# EAGLE board reva (EAGLE 9.6.2)
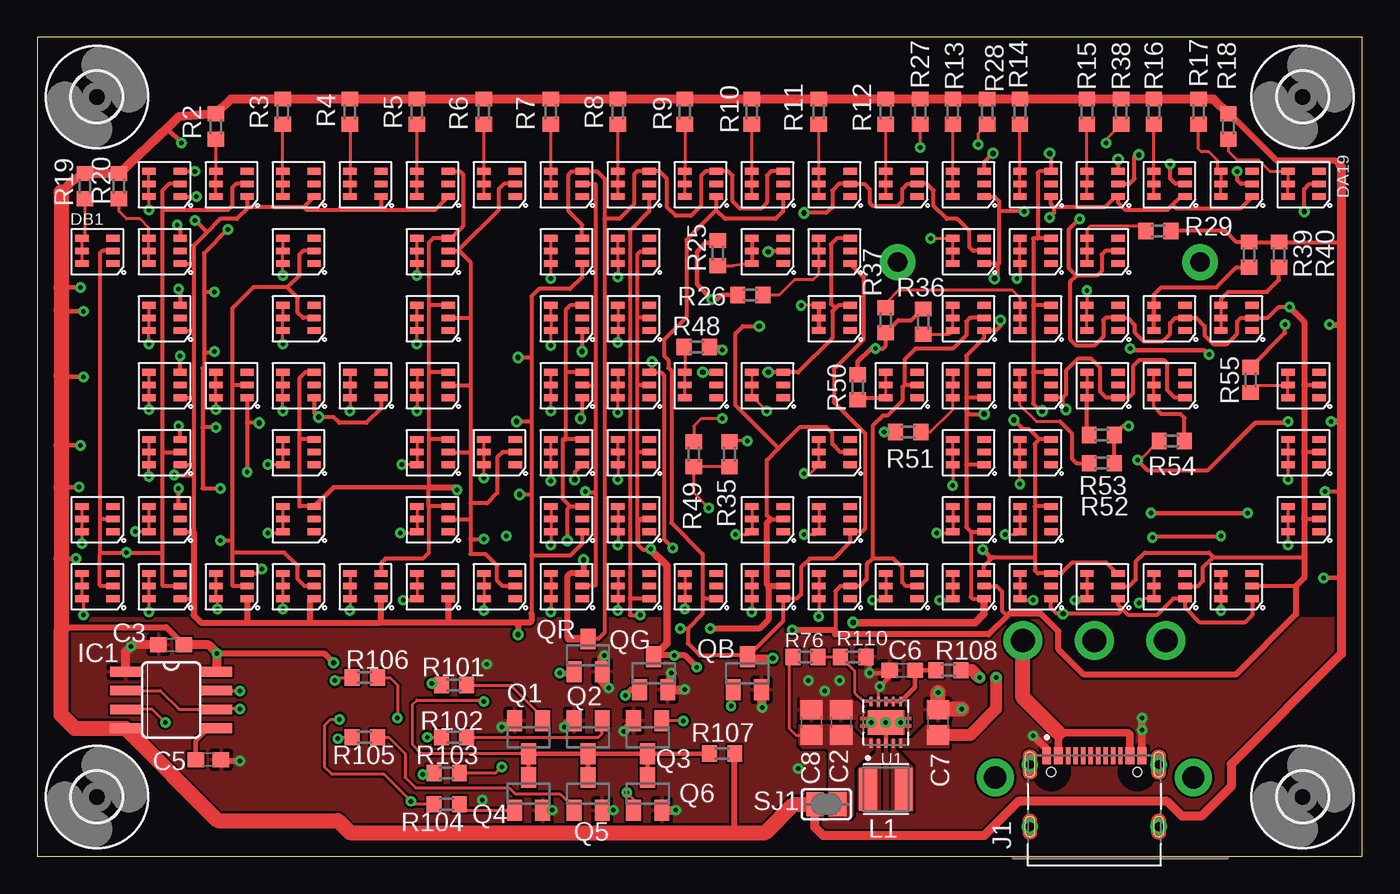
[diagram p2: board, top side]
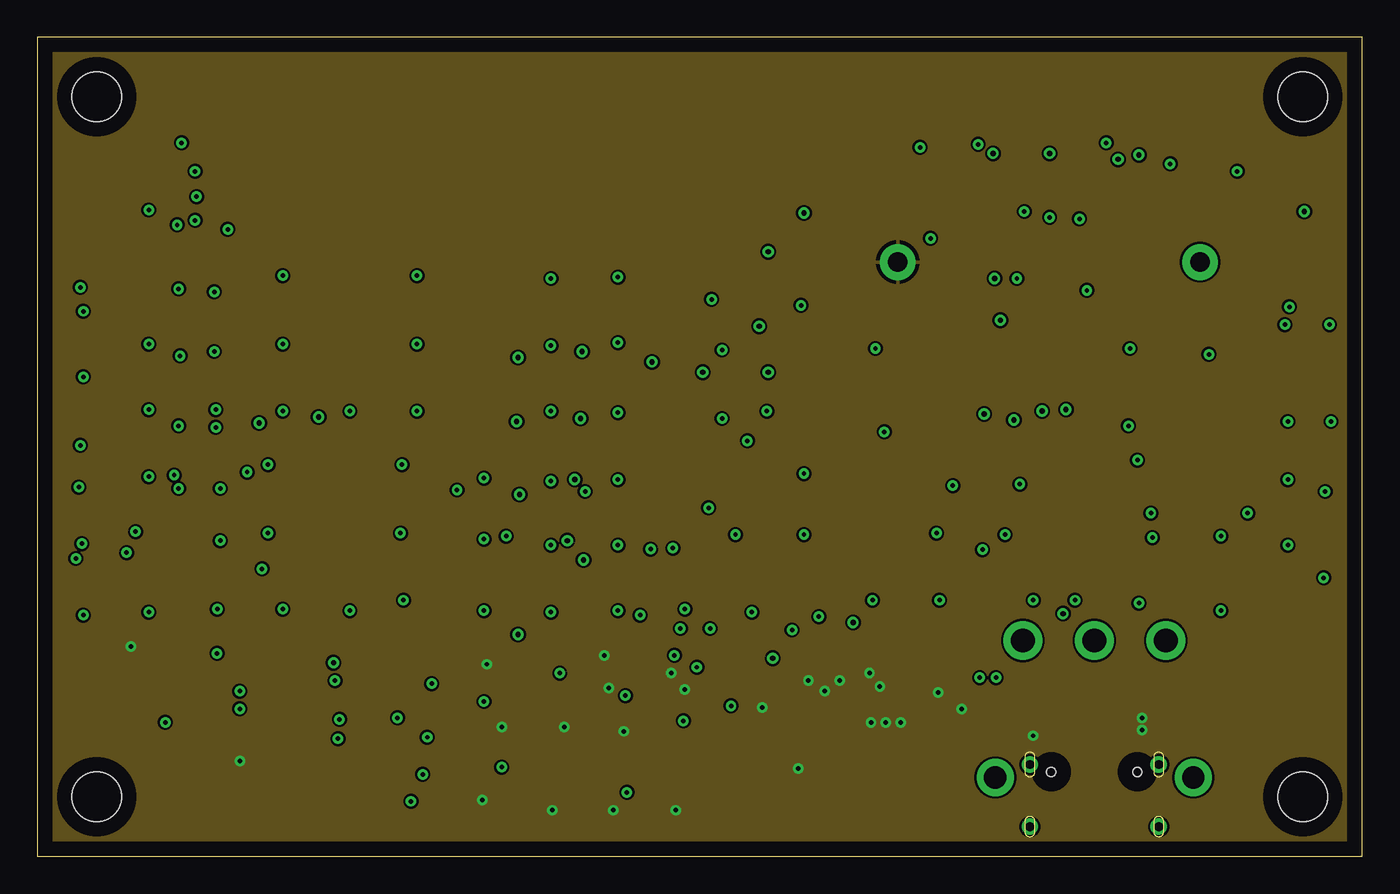
[diagram p3: board, inner layer Route2]
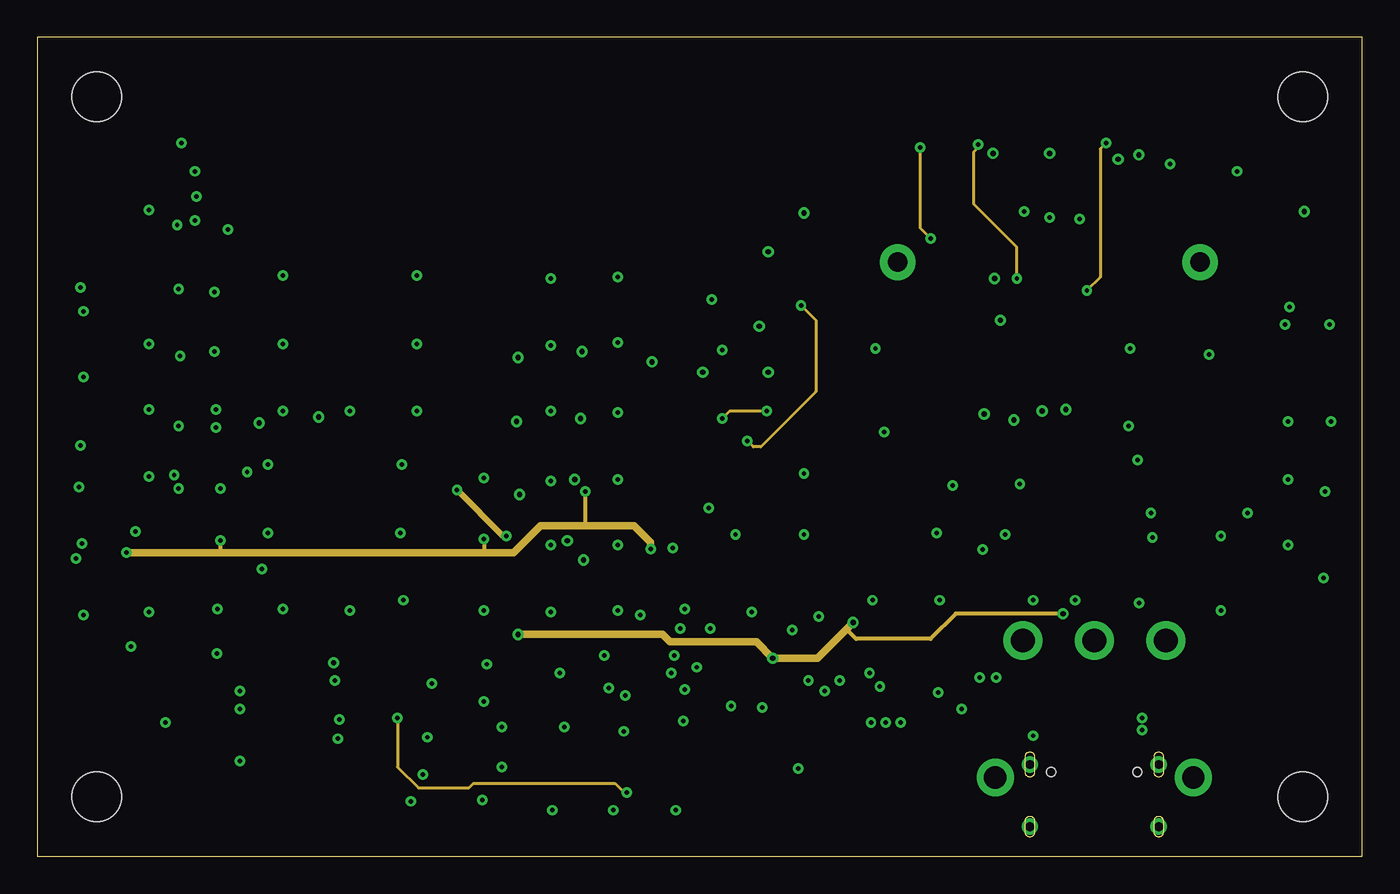
[diagram p4: board, inner layer Route15]
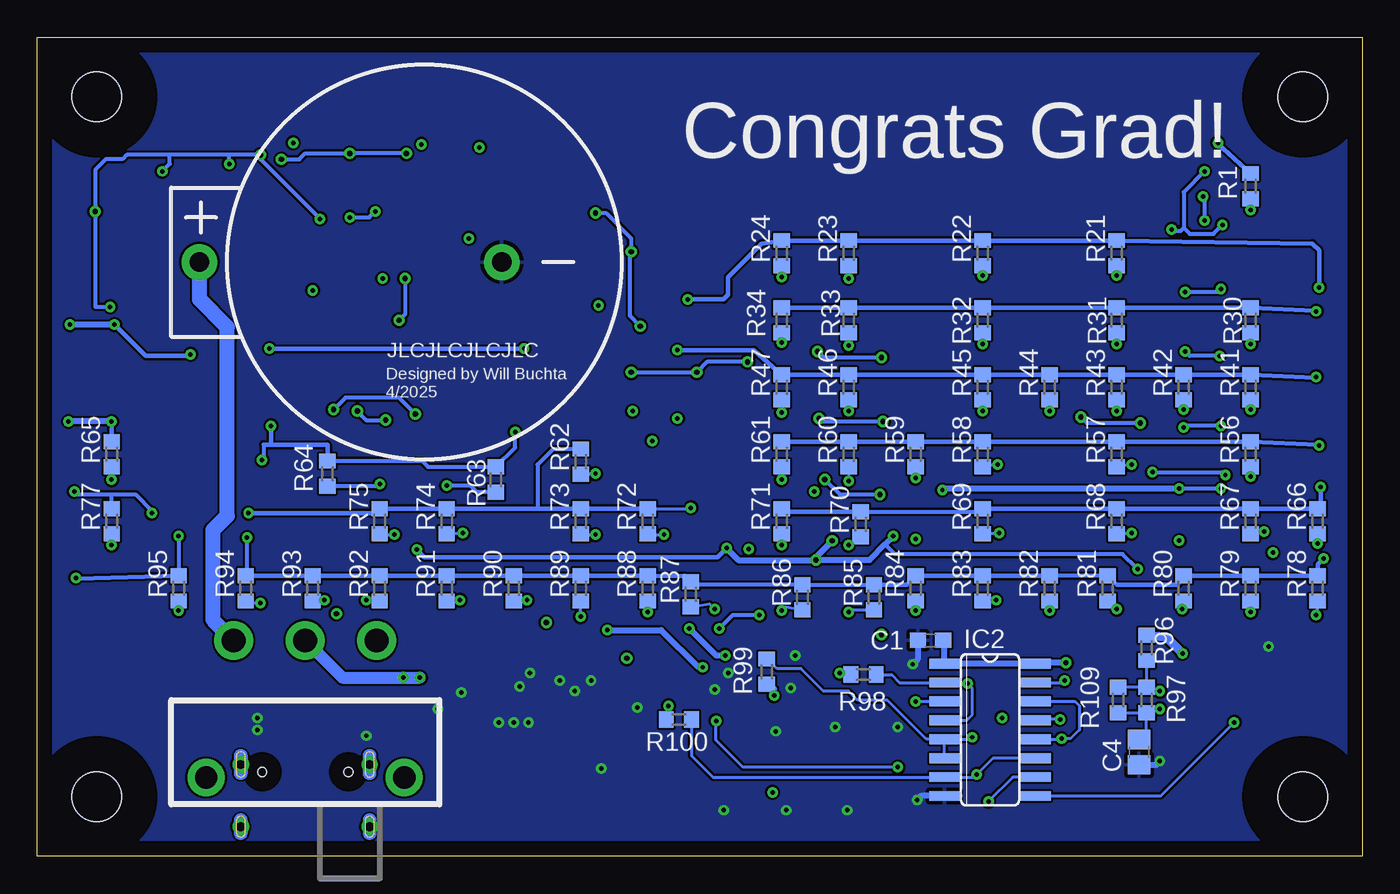
[diagram p5: board, bottom side, seen from below]

Size 89 x 55 mm. Coordinates in mm from the lower left corner, seen from the top.
Outline: 0,0 89,0 89,55 0,55 0,0
Copper layers (1+2*15+16): Top 0.035mm / dielectric 0.15mm / Route2 0.035mm / dielectric 0.15mm / Route15 0.035mm / dielectric 0.2mm / Bottom 0.035mm
Design rules "jlc-4 *": minimum track width 6mil, minimum drill 0.2mm, track to track 6mil, track to pad 6mil, pad to pad 6mil, via to via 6mil, smd to smd 0mil, copper to edge 1mm, drill to drill 0.33mm, minimum pad ring 0.25mm, minimum via ring 0.2mm, stop-mask expansion 4mil, vias tented up to drill 0.35mm, thermal gap 10mil

## Footprints (pad centres in the part's own frame; a part is rotated, then mirrored left to right if it is on the bottom)
CR240_CASE = drill 1.3 pad 2.4: NEG -5.2,0; POS 15.1,0
C0603 = smd 1.1 x 1: 1 -0.85,0; 2 0.85,0
C0805 = smd 1.3 x 1.5: 1 -0.85,0; 2 0.85,0
LED2727 = smd 0.9 x 0.45: 1 2.1,-1.7; 2 2.1,-0.85; 3 2.1,0; 4 0,0; 5 0,-0.85; 6 0,-1.7
3,3 = hole 3.3: 0,0
SO08 = smd 0.66 x 2.032: 1 -1.905,-3.073; 2 -0.635,-3.073; 3 0.635,-3.073; 4 1.905,-3.073; 5 1.905,3.073; 6 0.635,3.073; 7 -0.635,3.073; 8 -1.905,3.073
SO16 = smd 0.66 x 2.032: 1 -4.445,-3.073; 2 -3.175,-3.073; 3 -1.905,-3.073; 4 -0.635,-3.073; 5 0.635,-3.073; 6 1.905,-3.073; 7 3.175,-3.073; 8 4.445,-3.073; 9 4.445,3.073; 10 3.175,3.073; 11 1.905,3.073; 12 0.635,3.073; 13 -0.635,3.073; 14 -1.905,3.073; 15 -3.175,3.073; 16 -4.445,3.073
HRO_TYPE-C-31-M-12 = smd 0.6 x 1.14: A1_B12 -3.2,4.75; A4_B9 -2.4,4.75; B1_A12 3.2,4.75; B4_A9 2.4,4.75 | smd 0.3 x 1.14: A5 -1.25,4.75; A6 -0.25,4.75; A7 0.25,4.75; A8 1.25,4.75; B5 1.75,4.75; B6 0.75,4.75; B7 -0.75,4.75; B8 -1.75,4.75 | drill 0.6 pad 0.9: S1 -4.325,4.17; S2 4.325,4.17; S3 -4.325,0; S4 4.325,0 | hole 0.6: -2.89,3.68; 2.89,3.68
IND_LQH3NPN2R2MJRL = smd 1.2 x 2.9: 1 -1.2,0; 2 1.2,0
SW-K31391B = drill 1.6 pad 2.6: COM 0,0; L -4.8,0; R 4.8,0 | drill 1.5 pad 2.5: P$4 -6.65,9.2; P$5 6.65,9.2
SOT23 = smd 1 x 1.4: 1 -0.95,-1.1; 2 0.95,-1.1; 3 0,1.1
R0603 = smd 1 x 1.1: 1 -0.85,0; 2 0.85,0
SJ = smd 1.168 x 1.6: 1 -0.762,0; 2 0.762,0
VREG_V62/16624-01YE = smd 0.6 x 0.24: 1 -1.4,1; 2 -1.4,0.5; 3 -1.4,0; 4 -1.4,-0.5; 5 -1.4,-1; 6 1.4,-1; 7 1.4,-0.5; 8 1.4,0; 9 1.4,0.5; 10 1.4,1 | smd 1.65 x 2.4: 11 0,0

## Placement (x,y rotation side)
BAT1  CR2450  [CR240_CASE]  63,39.9 180 bottom
C1  100n  [C0603]  29,14.5 180 bottom
C2  10u  [C0805]  54,9 90 top
C3  100n  [C0603]  9,14.2 180 top
C4  10u  [C0805]  15,7 270 bottom
C5  100n  [C0603]  11.5,6.5 0 top
C6  100n  [C0603]  58.1,12.5 180 top
C7  10u  [C0805]  60.5,9 90 top
C8  10u  [C0805]  52,9 90 top
DA2  RGB_LED_XL  [LED2727]  7.5,46 0 top
DA3  RGB_LED_XL  [LED2727]  12,46 0 top
DA4  RGB_LED_XL  [LED2727]  16.5,46 0 top
DA5  RGB_LED_XL  [LED2727]  21,46 0 top
DA6  RGB_LED_XL  [LED2727]  25.5,46 0 top
DA7  RGB_LED_XL  [LED2727]  30,46 0 top
DA8  RGB_LED_XL  [LED2727]  34.5,46 0 top
DA9  RGB_LED_XL  [LED2727]  39,46 0 top
DA10  RGB_LED_XL  [LED2727]  43.5,46 0 top
DA11  RGB_LED_XL  [LED2727]  48,46 0 top
DA12  RGB_LED_XL  [LED2727]  52.5,46 0 top
DA13  RGB_LED_XL  [LED2727]  57,46 0 top
DA14  RGB_LED_XL  [LED2727]  61.5,46 0 top
DA15  RGB_LED_XL  [LED2727]  66,46 0 top
DA16  RGB_LED_XL  [LED2727]  70.5,46 0 top
DA17  RGB_LED_XL  [LED2727]  75,46 0 top
DA18  RGB_LED_XL  [LED2727]  79.5,46 0 top
DA19  RGB_LED_XL  [LED2727]  84,46 0 top
DB1  RGB_LED_XL  [LED2727]  3,41.5 0 top
DB2  RGB_LED_XL  [LED2727]  7.5,41.5 0 top
DB4  RGB_LED_XL  [LED2727]  16.5,41.5 0 top
DB6  RGB_LED_XL  [LED2727]  25.5,41.5 0 top
DB8  RGB_LED_XL  [LED2727]  34.5,41.5 0 top
DB9  RGB_LED_XL  [LED2727]  39,41.5 0 top
DB11  RGB_LED_XL  [LED2727]  48,41.5 0 top
DB12  RGB_LED_XL  [LED2727]  52.5,41.5 0 top
DB14  RGB_LED_XL  [LED2727]  61.5,41.5 0 top
DB15  RGB_LED_XL  [LED2727]  66,41.5 0 top
DB16  RGB_LED_XL  [LED2727]  70.5,41.5 0 top
DC2  RGB_LED_XL  [LED2727]  7.5,37 0 top
DC4  RGB_LED_XL  [LED2727]  16.5,37 0 top
DC6  RGB_LED_XL  [LED2727]  25.5,37 0 top
DC8  RGB_LED_XL  [LED2727]  34.5,37 0 top
DC9  RGB_LED_XL  [LED2727]  39,37 0 top
DC12  RGB_LED_XL  [LED2727]  52.5,37 0 top
DC14  RGB_LED_XL  [LED2727]  61.5,37 0 top
DC15  RGB_LED_XL  [LED2727]  66,37 0 top
DC16  RGB_LED_XL  [LED2727]  70.5,37 0 top
DC17  RGB_LED_XL  [LED2727]  75,37 0 top
DC18  RGB_LED_XL  [LED2727]  79.5,37 0 top
DD2  RGB_LED_XL  [LED2727]  7.5,32.5 0 top
DD3  RGB_LED_XL  [LED2727]  12,32.5 0 top
DD4  RGB_LED_XL  [LED2727]  16.5,32.5 0 top
DD5  RGB_LED_XL  [LED2727]  21,32.5 0 top
DD6  RGB_LED_XL  [LED2727]  25.5,32.5 0 top
DD8  RGB_LED_XL  [LED2727]  34.5,32.5 0 top
DD9  RGB_LED_XL  [LED2727]  39,32.5 0 top
DD10  RGB_LED_XL  [LED2727]  43.5,32.5 0 top
DD11  RGB_LED_XL  [LED2727]  48,32.5 0 top
DD13  RGB_LED_XL  [LED2727]  57,32.5 0 top
DD14  RGB_LED_XL  [LED2727]  61.5,32.5 0 top
DD15  RGB_LED_XL  [LED2727]  66,32.5 0 top
DD16  RGB_LED_XL  [LED2727]  70.5,32.5 0 top
DD17  RGB_LED_XL  [LED2727]  75,32.5 0 top
DD19  RGB_LED_XL  [LED2727]  84,32.5 0 top
DE2  RGB_LED_XL  [LED2727]  7.5,28 0 top
DE4  RGB_LED_XL  [LED2727]  16.5,28 0 top
DE6  RGB_LED_XL  [LED2727]  25.5,28 0 top
DE7  RGB_LED_XL  [LED2727]  30,28 0 top
DE8  RGB_LED_XL  [LED2727]  34.5,28 0 top
DE9  RGB_LED_XL  [LED2727]  39,28 0 top
DE12  RGB_LED_XL  [LED2727]  52.5,28 0 top
DE14  RGB_LED_XL  [LED2727]  61.5,28 0 top
DE15  RGB_LED_XL  [LED2727]  66,28 0 top
DE19  RGB_LED_XL  [LED2727]  84,28 0 top
DF1  RGB_LED_XL  [LED2727]  3,23.5 0 top
DF2  RGB_LED_XL  [LED2727]  7.5,23.5 0 top
DF4  RGB_LED_XL  [LED2727]  16.5,23.5 0 top
DF6  RGB_LED_XL  [LED2727]  25.5,23.5 0 top
DF8  RGB_LED_XL  [LED2727]  34.5,23.5 0 top
DF9  RGB_LED_XL  [LED2727]  39,23.5 0 top
DF11  RGB_LED_XL  [LED2727]  48,23.5 0 top
DF12  RGB_LED_XL  [LED2727]  52.5,23.5 0 top
DF14  RGB_LED_XL  [LED2727]  61.5,23.5 0 top
DF15  RGB_LED_XL  [LED2727]  66,23.5 0 top
DF19  RGB_LED_XL  [LED2727]  84,23.5 0 top
DG1  RGB_LED_XL  [LED2727]  3,19 0 top
DG2  RGB_LED_XL  [LED2727]  7.5,19 0 top
DG3  RGB_LED_XL  [LED2727]  12,19 0 top
DG4  RGB_LED_XL  [LED2727]  16.5,19 0 top
DG5  RGB_LED_XL  [LED2727]  21,19 0 top
DG6  RGB_LED_XL  [LED2727]  25.5,19 0 top
DG7  RGB_LED_XL  [LED2727]  30,19 0 top
DG8  RGB_LED_XL  [LED2727]  34.5,19 0 top
DG9  RGB_LED_XL  [LED2727]  39,19 0 top
DG10  RGB_LED_XL  [LED2727]  43.5,19 0 top
DG11  RGB_LED_XL  [LED2727]  48,19 0 top
DG12  RGB_LED_XL  [LED2727]  52.5,19 0 top
DG13  RGB_LED_XL  [LED2727]  57,19 0 top
DG14  RGB_LED_XL  [LED2727]  61.5,19 0 top
DG15  RGB_LED_XL  [LED2727]  66,19 0 top
DG16  RGB_LED_XL  [LED2727]  70.5,19 0 top
DG17  RGB_LED_XL  [LED2727]  75,19 0 top
DG18  RGB_LED_XL  [LED2727]  79.5,19 0 top
H1  MOUNT-HOLE3.3  [3,3]  85,51 0 top
H2  MOUNT-HOLE3.3  [3,3]  4,51 0 top
H3  MOUNT-HOLE3.3  [3,3]  4,4 0 top
H4  MOUNT-HOLE3.3  [3,3]  85,4 0 top
IC1  LM555D  [SO08]  9,10.5 270 top
IC2  74HC174D  [SO16]  25,8.5 270 bottom
J1  TYPE-C-31-M-12  [HRO_TYPE-C-31-M-12]  71,2 0 top
L1  LQH3NPN2R2MJRL  [IND_LQH3NPN2R2MJRL]  57,4.5 180 top
PWR  SWITCH-BRUH  [SW-K31391B]  71,14.5 180 bottom
Q1  [SOT23]  33,8 180 top
Q2  [SOT23]  37,8 180 top
Q3  [SOT23]  41,8 180 top
Q4  [SOT23]  33,4.2 0 top
Q5  [SOT23]  37,4.2 0 top
Q6  [SOT23]  41,4.2 0 top
QB  [SOT23]  47.7,12.3 0 top
QG  [SOT23]  41.4,12.3 0 top
QR  [SOT23]  37,13.5 0 top
R1  470  [R0603]  7.5,45 90 bottom
R2  470  [R0603]  12,49 90 top
R3  [R0603]  16.5,50 90 top
R4  [R0603]  21,50 90 top
R5  [R0603]  25.5,50 90 top
R6  [R0603]  30,50 90 top
R7  [R0603]  34.5,50 90 top
R8  [R0603]  39,50 90 top
R9  [R0603]  43.5,50 90 top
R10  [R0603]  48,50 90 top
R11  [R0603]  52.5,50 90 top
R12  [R0603]  57,50 90 top
R13  [R0603]  61.5,50 90 top
R14  [R0603]  66,50 90 top
R15  [R0603]  70.5,50 90 top
R16  [R0603]  75,50 90 top
R17  [R0603]  78,50 90 top
R18  [R0603]  80,49 90 top
R19  [R0603]  3.2,45 90 top
R20  [R0603]  5.5,45 90 top
R21  [R0603]  16.5,40.5 90 bottom
R22  [R0603]  25.5,40.5 90 bottom
R23  [R0603]  34.5,40.5 90 bottom
R24  [R0603]  39,40.5 90 bottom
R25  [R0603]  45.7,40.5 90 top
R26  [R0603]  47.9,37.7 180 top
R27  [R0603]  59.3,50 90 top
R28  [R0603]  63.8,50 90 top
R29  [R0603]  75.3,42 0 top
R30  [R0603]  7.5,36 90 bottom
R31  [R0603]  16.5,36 90 bottom
R32  [R0603]  25.5,36 90 bottom
R33  [R0603]  34.5,36 90 bottom
R34  [R0603]  39,36 90 bottom
R35  [R0603]  46.5,27 270 top
R36  [R0603]  59.5,35.9 90 top
R37  [R0603]  57,36 270 top
R38  [R0603]  72.8,50 90 top
R39  [R0603]  81.4,40.4 90 top
R40  [R0603]  83.4,40.4 90 top
R41  [R0603]  7.5,31.5 90 bottom
R42  [R0603]  12,31.5 90 bottom
R43  [R0603]  16.5,31.5 90 bottom
R44  [R0603]  21,31.5 90 bottom
R45  [R0603]  25.5,31.5 90 bottom
R46  [R0603]  34.5,31.5 90 bottom
R47  [R0603]  39,31.5 90 bottom
R48  [R0603]  44.3,34.2 0 top
R49  [R0603]  44.1,27 270 top
R50  [R0603]  55.1,31.5 90 top
R51  [R0603]  58.5,28.5 180 top
R52  [R0603]  71.5,26.4 0 top
R53  [R0603]  71.5,28.3 0 top
R54  [R0603]  76.2,27.9 180 top
R55  [R0603]  81.5,32 90 top
R56  [R0603]  7.5,27 90 bottom
R57  [R0603]  16.5,27 90 bottom
R58  [R0603]  25.5,27 90 bottom
R59  [R0603]  30,27 90 bottom
R60  [R0603]  34.5,27 90 bottom
R61  [R0603]  39,27 90 bottom
R62  [R0603]  52.5,26.5 90 bottom
R63  [R0603]  58.2,25.3 90 bottom
R64  [R0603]  69.5,25.7 90 bottom
R65  [R0603]  84,27 90 bottom
R66  [R0603]  3,22.5 90 bottom
R67  [R0603]  7.5,22.5 90 bottom
R68  [R0603]  16.5,22.5 90 bottom
R69  [R0603]  25.5,22.5 90 bottom
R70  [R0603]  33.7,22.3 90 bottom
R71  [R0603]  39,22.5 90 bottom
R72  [R0603]  48,22.5 90 bottom
R73  [R0603]  52.5,22.5 90 bottom
R74  [R0603]  61.5,22.5 90 bottom
R75  [R0603]  66,22.5 90 bottom
R76  71k  [R0603]  51.6,13.4 180 top
R77  [R0603]  84,22.5 90 bottom
R78  [R0603]  3,18 90 bottom
R79  [R0603]  7.5,18 90 bottom
R80  [R0603]  12,18 90 bottom
R81  [R0603]  17.1,18 90 bottom
R82  [R0603]  21,18 90 bottom
R83  [R0603]  25.5,18 90 bottom
R84  [R0603]  30,18 90 bottom
R85  [R0603]  32.8,17.4 90 bottom
R86  [R0603]  37.6,17.4 90 bottom
R87  [R0603]  45.1,17.6 90 bottom
R88  [R0603]  48,18 90 bottom
R89  [R0603]  52.5,18 90 bottom
R90  [R0603]  57,18 90 bottom
R91  [R0603]  61.5,18 90 bottom
R92  [R0603]  66,18 90 bottom
R93  [R0603]  70.5,18 90 bottom
R94  [R0603]  75,18 90 bottom
R95  [R0603]  79.5,18 90 bottom
R96  75k  [R0603]  14.5,14 90 bottom
R97  75k  [R0603]  14.5,10.5 90 bottom
R98  470  [R0603]  33.5,12.2 0 bottom
R99  470  [R0603]  40,12.4 90 bottom
R100  470  [R0603]  45.9,9.2 0 bottom
R101  4k7  [R0603]  28,11.5 180 top
R102  4k7  [R0603]  28,8 180 top
R103  4k7  [R0603]  27.5,5.6 180 top
R104  4k7  [R0603]  27.5,3.5 180 top
R105  4k7  [R0603]  22,8 180 top
R106  4k7  [R0603]  22,12 180 top
R107  4k7  [R0603]  46,6.9 180 top
R108  100  [R0603]  61.2,12.5 0 top
R109  75k  [R0603]  16.4,10.5 90 bottom
R110  75k  [R0603]  54.8,13.4 180 top
SJ1  [SJ]  53,3.5 180 top
U1  TPS63000DRCR  [VREG_V62/16624-01YE]  57,9 90 top

## Tracks (layer width: path | path; a pad name or v marks a point on that pad's centre or on a via)
5VBUCK
  Top 0.2: R76.2 50.5,13.1 50.5,8.6 50.95,8.15 C8.1
  pour Top (no thermals): 56.1,7.9 55.3,7.9 54.7,8.5 54.7,8.8 51.2,8.8 51.2,7.5 51.4,7.3 53,7.3 53.2,7.1 53.2,2.7 53.3,2.6 54.6,2.6 54.8,2.8 54.8,5.9 56.1,7.2
+5V  (via drill 0.3, 0.3 pad 0.45, 0.3 pad 0.5, 0.35)
  Top 0.2: R35.2 R49.2 44.1,24.4 v45.1,23.4 | R38.2 72.6,50.85 | R28.2 63.6,50.85 | R27.2 59.4,50.85 | R54.2 74.05,26.6 v73.9,26.6
  Top 0.254: v74.9,21.4 75,21.5 v79.5,21.5 | v86.5,24.5 87.5,24.5 87.6,24.6 | 87.6,40.9 87.45,41.05 | R39.2 81.15,41.05 | R39.2 80.55,41.25 79.8,42 R29.2 76.05,41.9 | R39.2 R40.2 87.55,41.25 87.6,41.2 | R52.2 R53.2 72.95,28.9 v73.3,28.9 | 80.2,27.5 78.6,25.9 74.6,25.9 v73.9,26.6 | R55.2 83.8,35.15 v83.8,35.7 | v56.3,34.1 56.8,34.1 57,34.3 R37.2 57.85,36 58.7,36 59.45,36.75
  Top 0.305: v9.7,47.9 8.78,48.83 8.78,48.92 | v2.9,38.2 1.6,38.2 | v3.1,36.6 1.7,36.6 1.6,36.7 | v3.1,32.2 1.7,32.2 1.6,32.3 | 87.5,29.2 87.6,29.1 | R53.2 72.25,28.2 | v2.9,27.6 1.6,27.6 | v2.8,24.8 1.6,24.8 | v81.3,23.05 v74.8,23.05 | v86.4,18.7 87.6,18.7 | v2.6,20 1.6,20 | R26.2 46,37.7 45.7,37.4 v45.3,37.4 44.3,38.4 44.3,40.6 44.9,41.2 45.65,41.2 R25.2 46.05,41.35 | 59.45,36.75 R36.2 | 80.2,27.5 81.8,29.1 83.9,29.1 v84,29.2 | R50.2 55.1,33.2 56,34.1 v56.3,34.1 | R51.2 v56.9,28.5 | R48.2 45.8,34.2 v46,34 | v78.7,33.7 78.4,34 73.5,34 v73.4,34.1
  Top 0.406: R18.2 80.31,49.65 83.23,46.73 87.17,46.73 87.5,46.4 | v86.8,35.7 87.4,35.7 87.6,35.9 | v86.9,29.2 87.5,29.2 | 1.6,15.1 1.9,15.4 8.65,15.4 C3.1 | v12.07,13.63 19.27,13.63 v19.9,13 | R107.1 46.8,6.75 46.8,1.6
  Top 0.61: R18.2 79,50.85 R17.2 R16.2 72.6,50.85 R15.2 R14.2 63.6,50.85 R13.2 59.4,50.85 R12.2 R11.2 R10.2 R9.2 R8.2 R7.2 R6.2 R5.2 R4.2 R3.2 13,50.85 R2.2 9.5,49.65 8.78,48.92 R20.2 R19.2 2.38,45.38 1.6,44.59 | 87.5,46.4 87.6,46.3 87.6,41.2 87.6,40.9 87.6,35.9 87.6,29.1 87.6,24.6 87.6,18.7 87.6,13.6 80.2,6.2 80.2,4.7 78.2,2.7 76.9,2.7 75.9,3.7 65.9,3.7 63.6,1.4 52.8,1.4 52.24,1.96 SJ1.2 | IC1.8 v12.07,13.63 11.5,14.2 C3.1
  Top 1.016: 1.6,44.59 1.6,38.2 1.6,36.7 1.6,32.3 1.6,27.6 1.6,24.8 1.6,20 1.6,15.1 1.6,9.5 2.5,8.6 IC1.4 12.12,2.4 20.2,2.4 21,1.6 46.8,1.6 48.9,1.6 50.8,3.5 SJ1.2
  Bottom 0.2: R72.2 45.15,23.35 v45.1,23.4
  Bottom 0.254: 73.8,27.65 73.8,26.7 v73.9,26.6 | 74.7,23.05 v74.8,23.05 | R94.2 74.9,18.75 v74.9,21.4 | v79.5,21.5 R95.2 | 84.1,24.3 86.3,24.3 v86.5,24.5 | 84.1,24.3 82.4,24.3 81.3,23.2 v81.3,23.05 | R64.2 63.15,26.55 62.75,26.15 R63.2 56.9,27.45 v56.9,28.5 | R62.2 54.35,27.35 55.4,26.3 55.4,23.35 | R77.2 84,24.2 84.1,24.3 | R88.2 45.5,18.85 R87.2 | 45.04,18.33 44.96,18.25 R86.2 32.95,18.25 32.88,18.18 | R82.2 R81.2 16.5,18.25 | R70.2 25.7,23.15 R69.2
  Bottom 0.305: R1.2 9.7,47.85 v9.7,47.9 | v2.9,38.2 2.9,40.7 3.35,41.15 R21.2 R22.2 R23.2 R24.2 40.35,41.15 42.6,38.9 42.6,37.7 42.9,37.4 v45.3,37.4 | v3.1,36.6 3.15,36.65 R30.2 R31.2 R32.2 R33.2 R34.2 | v3.1,32.2 3.15,32.15 R41.2 R42.2 R43.2 R44.2 R45.2 R46.2 R47.2 40.85,34 v46,34 | R65.2 v84,29.2 | 73.8,27.65 73.3,27.65 | 73.3,27.65 69.5,27.65 R64.2 | 73.3,27.65 v73.3,28.9 | R62.2 52.7,27.35 | R61.2 R60.2 R59.2 R58.2 R57.2 R56.2 2.95,27.65 v2.9,27.6 | v2.8,24.8 2.8,23.35 R66.2 R67.2 R68.2 R69.2 | R70.2 38.8,23.15 R71.2 | R72.2 R73.2 55.4,23.35 R74.2 R75.2 66.1,23.05 74.7,23.05 | R95.2 86.35,18.65 v86.4,18.7 | R94.2 R93.2 R92.2 R91.2 R90.2 R89.2 R88.2 | R87.2 45.04,18.33 44.9,18.05 | 33,18.05 32.88,18.18 R85.2 30.6,18.25 R84.2 R83.2 R82.2 | 16.5,18.25 12.4,18.25 R80.2 R79.2 R78.2 3,19.6 v2.6,20 | v78.7,33.7 78.8,33.6 81.7,33.6 v83.8,35.7 | v73.4,34.1 v56.3,34.1 | 83.7,23.05 R77.2
  Bottom 0.406: v83.8,35.7 v86.8,35.7 | v84,29.2 v86.9,29.2 | C1.1 28.07,14.42 IC2.1 IC2.16 21.87,13 v19.9,13
  Bottom 0.61: R96.2 13.19,14.74 v12.07,13.63
B-  (via drill 0.3 pad 0.45, 0.3 pad 0.5, 0.35)
  Top 0.254: DA9.1 41.1,43.3 39.8,42 39.8,17.3 | 39.8,17.3 39.8,16.2 v40.5,16.2 | DA10.1 45.6,43.4 | 45.6,43.4 43.6,41.4 43.6,36.2 42.1,34.7 42.1,33.6 42.4,33.3 42.4,32.8 42.6,32.6 42.6,22.4 44.7,20.3 44.7,17.3 | DA3.1 14.1,43.6 | 14.1,43.6 14.1,43.5 13.4,42.8 12.3,42.8 11.3,41.8 | 11.3,41.8 10.5,41 10.5,39.8 | 10.5,39.8 10.5,35.3 | 10.5,35.3 10.5,30.8 | 10.5,30.8 10.5,26.2 | 10.5,26.2 10.5,25.6 | 10.5,25.6 10.5,21.8 DF2.1 | DG2.1 10.5,17.3 | DE2.1 10.4,26.3 10.5,26.2 | DD2.1 10.5,30.8 | DC2.1 10.5,35.3 | DB2.1 10.5,39.8 | DA2.1 v10.7,44.3 | v10.6,42.7 11.3,42 11.3,41.8 | DA4.1 17.9,43.6 | 17.9,43.6 14.1,43.6 | DA5.1 23.1,43.4 | 23.1,43.4 18.1,43.4 17.9,43.6 | DA6.1 26.7,43.4 23.1,43.4 | DD3.1 14.1,29.1 | 14.1,29.1 v14.1,25.8 | DD4.1 18.6,29.8 v18.9,29.5 19.9,29.5 20.3,29.1 22.1,29.1 23.1,30.1 DD5.1 | v14.9,29.1 14.1,29.1 | DB8.1 36.6,38.9 35.8,38.1 33.7,38.1 33.2,37.6 33.2,33.5 | 33.2,33.5 33.2,29.2 | 33.2,29.2 33.2,24.3 | 33.2,24.3 33.2,20.2 | 33.2,20.2 33.2,16.3 | DF8.1 36.6,21 35.8,20.2 33.2,20.2 | DG6.1 27.6,17.2 | 23.1,17.2 DG5.1 | DG9.1 39.8,17.3 | DC8.1 v36.6,33.9 | v32.3,33.5 33.2,33.5 | DD8.1 36.6,29.5 v36.5,29.4 | v32.2,29.2 33.2,29.2 | DE8.1 36.1,25.8 v36.1,25.3 | v32.4,24.3 33.2,24.3 | DA11.1 50.1,43.3 49.6,42.8 46.2,42.8 45.6,43.4 | DG10.1 44.7,17.3 | DB12.1 55.5,38.9 55.5,34.7 53.5,32.7 53.5,30.5 55.6,28.4 55.6,22 55.4,21.8 DF12.1 54.6,21.1 53.5,20 51.9,20 51.3,19.4 51.3,17.6 51,17.3 DG11.1 50.1,15.8 QB.3 47.6,13.5 45.4,13.5 | DA14.1 64.3,44.3 64.6,44 64.6,43.3 | 64.5,39.8 64.6,39.8 64.6,43.3 | 64.5,39.8 DB14.1 | 62.4,30.8 62.4,33.6 63.6,34.8 DC14.1 64.4,35.3 64.7,35.6 v64.7,36 | DD14.1 62.4,30.8 | 62.7,21.8 62.4,22.1 62.4,26.3
  Top 0.254: 62.7,21.8 DF14.1 | 62.4,30.8 62.4,29.9 | 62.4,29.9 62.4,26.3 | DE14.1 62.4,26.3 | 62.7,21.8 62.7,17.4 62.8,17.3 DG14.1 | 64.5,39.8 64.5,39 v64.3,38.8 | DG18.1 81.6,16.2 81.1,15.7 78.1,15.7 77.1,16.7 DG17.1 76.3,17.3 75.2,16.2 73.3,16.2 72.9,16.6 | 68.9,30.8 69.1,31 69.1,32.6 69.9,33.4 70.8,33.4 71.4,32.8 71.4,31.2 71.8,30.8 DD16.1 73.3,30.8 73.6,31.1 73.6,32.9 74,33.3 75.7,33.3 75.9,33.1 75.9,31.3 76.4,30.8 DD17.1 | 68.9,30.8 DD15.1 | DG16.1 72.6,16.9 72.9,16.6 | 72.9,16.6 72.6,16.3 v68.9,16.3 68.5,16.3 68.1,16.7 DG15.1 | 68.3,43.6 71.7,43.6 72.4,44.3 DA16.1 72.6,43.9 73.1,43.4 75.9,43.4 76.25,43.75 | DA15.1 68.1,43.8 68.3,43.6 | DA17.1 76.8,44.3 76.25,43.75 | 62.4,29.9 62.6,29.7 v63.6,29.7 | v69.1,30 68.9,30.2 68.9,30.8 | DA18.1 80.8,43.5 76.5,43.5 76.25,43.75 | 68.3,43.6 68.3,43.2 v68,42.9 | v66.3,43.3 64.6,43.3 | 44.7,17.3 44.7,16.3 43.7,15.3 | 43.7,15.3 43.7,14.3 44.5,13.5 45.4,13.5 | 45.4,13.5 | v43.2,15.3 43.7,15.3 | v9.2,25.6 10.5,25.6 | DG4.1 18.3,17 18.3,17.2
  Top 0.406: 10.5,21.8 10.5,17.3 10.5,16.2 11,15.7 14.1,15.7 | 18.3,17.2 18.3,15.7 | 18.3,15.7 23,15.7 | 23,15.7 23.1,15.8 23.1,17.2 | 32.3,15.7 33.1,15.7 33.2,15.8 33.2,16.3 | 32.3,15.7 27.6,15.7 | 27.6,15.7 23,15.7 | 27.6,17.2 27.6,15.7 | 14.1,15.7 18.3,15.7 | DG3.1 14.1,15.7 | 32.3,15.7 v32.3,14.9
  Top 0.508: v49.4,13.3 47.8,13.3 QB.3 | DG14.1 63.6,16.3 63,15.7 v54.8,15.7
  Route15 0.254: v68.9,16.3 61.7,16.3 60,14.6 55,14.6 54.35,15.25
  Route15 0.508: v32.3,14.9 42,14.9 42.5,14.4 48.3,14.4 v49.4,13.3 52.4,13.3 54.35,15.25 v54.8,15.7
  Bottom 0.254: v10.7,44.3 10.6,44.2 v10.6,42.7 | v18.9,29.5 18.5,29.1 v14.9,29.1 | v36.6,33.9 36.2,33.5 v32.3,33.5 | v36.5,29.4 36.3,29.2 v32.2,29.2 | v36.1,25.3 35.1,24.3 v32.4,24.3 | v64.3,38.8 64.3,36.4 v64.7,36 | v63.6,29.7 64.7,30.8 68.3,30.8 v69.1,30 | v68,42.9 66.7,42.9 v66.3,43.3 | v40.5,16.2 42.3,16.2 v43.2,15.3 | v14.1,25.8 9.4,25.8 v9.2,25.6
BUCK_IN  (via drill 0.3 pad 0.5)
  Top 0.813: v63.3,12 62.8,12.5 R108.2 | v64.4,12 64.4,9.9 62.65,8.15 C7.1
  Bottom 0.813: PWR.COM 68.5,12 v64.4,12 v63.3,12
  pour Top (no thermals): 57.9,7.9 58.8,7.9 59.7,8.8 61.2,8.8 61.2,7.3 57.9,7.3
CLK_1HZ  (via drill 0.3 pad 0.5)
  Top 0.2: v8.6,9 7.74,9.87 IC1.3
  Bottom 0.2: IC2.9 13.54,4.05 v8.6,9
CV
  Top 0.305: C5.1 10.65,7.75 11.49,8.6 IC1.5
DIN  (via drill 0.3 pad 0.5)
  Top 0.2: Q1.3 25.8,6.9 25.2,7.5 25.2,10.2 25.5,10.5 29.9,10.5 v30,10.4
  Top 0.305: Q4.3 Q1.3 Q2.3 | Q5.3 Q2.3 | Q6.3 Q3.3 | R107.2 Q3.3 | Q3.3 Q2.3
  Bottom 0.2: v30,10.4 IC2.3
DIS  (via drill 0.3 pad 0.5)
  Top 0.2: IC1.7 13.56,11.13 v13.6,11.1
  Bottom 0.2: R96.1 R97.2 | R97.2 R109.2 | v13.6,11.1 14.45,11.1 R97.2
FFQ1  (via drill 0.3 pad 0.5)
  Top 0.2: v26.5,11.6 27.25,11.6 R101.2
  Bottom 0.2: R98.2 31.6,12.2 31.07,11.68 IC2.2 28,11.6 v26.5,11.6 26.2,11.3 26.2,9.5 26.57,9.13 IC2.4
FFQ2  (via drill 0.3 pad 0.5)
  Top 0.2: v26.2,8 R102.2
  Bottom 0.2: IC2.5 26.34,7.87 v26.2,8 | IC2.6 IC2.5 | IC2.5 29.27,7.87 31.9,10.5 33.9,10.5 34.5,11.1 36.2,11.1 37.7,12.6 39.3,12.6 39.92,13.22 R99.2
FFQ3  (via drill 0.3 pad 0.5)
  Top 0.2: v25.9,5.5 26,5.6 R103.2
  Bottom 0.2: R100.2 45.05,6.75 43.6,5.3 28.1,5.3 IC2.7 26.07,5.33 v25.9,5.5 24.8,6.59 IC2.11
FFQ4  (via drill 0.3 pad 0.5)
  Top 0.2: R104.2 25.3,3.5 v25.1,3.7 23.3,5.5 19.8,5.5 19.3,6 19.3,8.8 19.7,9.2 v20.3,9.2
  Bottom 0.2: IC2.10 23.48,5.33 v25.1,3.7 | v20.3,9.2 21.86,9.2 IC2.13
FFQ5  (via drill 0.3 pad 0.5)
  Top 0.2: v20.2,7.9 20.3,8 R105.2
  Bottom 0.2: IC2.12 20.23,7.87 v20.2,7.9 19.6,7.9 19,8.5 19,10.1 19.3,10.4 IC2.14
FFQ6  (via drill 0.3 pad 0.5)
  Top 0.2: v20,11.8 20.2,12 R106.2
  Bottom 0.2: IC2.15 20.12,11.68 v20,11.8
G-  (via drill 0.3, 0.3 pad 0.45, 0.3 pad 0.5, 0.35)
  Top 0.152: 40.3,22.3 40.65,22.65 DF9.2 40.65,22.65 40.42,22.42 40.42,20.88 40.67,20.63 v41.2,20.63
  Top 0.254: DA8.2 37.45,45.15 37.5,45.1 37.5,31.6 | 37.5,31.6 37.5,24.4 | 37.5,24.4 37.5,18.2 36.65,18.2 DG8.2 | DB1.2 4.35,40.65 4.2,40.5 4.2,22.6 | 4.2,22.6 4.2,20.3 | 4.2,20.3 4.2,18.2 4.25,18.15 DG1.2 | DF1.2 4.25,22.65 4.2,22.6 | DA2.2 8.85,45.15 8.4,44.7 8.4,43.4 | 8.4,43.4 8.4,27.1 | 8.4,27.1 8.4,20.4 | 8.4,20.4 8.4,18.2 8.45,18.15 DG2.2 | DE2.2 9.55,27.1 8.4,27.1 | DA3.2 13.35,45.15 13.1,44.9 13.1,43.7 12.8,43.4 8.4,43.4 | DB4.2 17.85,40.65 17.6,40.4 17.6,39 16.8,38.2 | 16.8,38.2 14.5,38.2 13.1,36.8 13.1,31.7 | 13.1,31.7 13.1,21.2 | 13.1,21.2 13.1,20.4 | 13.1,20.4 13.1,18.2 13.15,18.15 DG3.2 | DD3.2 13.15,31.65 13.1,31.7 | DC4.2 17.85,36.15 17.5,36.5 17.5,37.5 16.8,38.2 | DG4.2 17.95,18.15 17.5,18.6 17.5,19.5 16.6,20.4 13.1,20.4 | DB6.2 28.35,40.65 | 28.35,40.65 29.1,39.9 29.1,36.1 | 29.1,36.1 29.1,31.6 | 29.1,31.6 29.1,27.1 | 29.1,27.1 29.1,23.7 | 29.1,23.7 29.1,22.6 | 29.1,22.6 29.1,21.3 | 29.1,21.3 29.1,20.3 30.1,20.3 30.9,19.5 30.9,18.5 31.25,18.15 DG7.2 | DC6.2 29.05,36.15 29.1,36.1 | DD6.2 29.05,31.65 29.1,31.6 | DE6.2 29.05,27.15 29.1,27.1 | DF6.2 29.05,22.65 29.1,22.6 | DA7.2 31.35,45.15 31,44.8 31,43.4 28.35,40.75 28.35,40.65 | DE7.2 31.25,27.15 30.9,26.8 30.9,24.4 30.2,23.7 29.1,23.7 | DD8.2 37.45,31.65 37.5,31.6 | DB9.2 41.05,40.6 40.5,40.6 40.3,40.4 40.3,36.1 | 40.3,36.1 40.3,31.7 | 40.3,31.7 40.3,27.1 | 40.3,27.1 40.3,22.6 | 40.3,22.6 40.3,22.3 40.3,21 40.7,20.6 41.2,20.6 | 40.3,22.6 40.35,22.65 DF9.2 | DE9.2 40.35,27.15 40.3,27.1 | DD9.2 40.35,31.65 40.3,31.7 | DC9.2 40.35,36.15 40.3,36.1 | 49.2,18.15 49.15,18.15 49,18.3 | DF11.2 49.25,22.65 49,22.9 49,26.6 49.8,27.4 | DE12.2 53.95,27.15 53.4,27.7 53.4,28.4 53,28.8 51.2,28.8 49.8,27.4
  Top 0.254: 49.8,27.4 46.9,30.3 46.9,35.1 47.4,35.6 v48.5,35.6 | v49.1,40.6 49.15,40.65 DB11.2 | v51.5,43.2 53,43.2 53.4,43.6 53.4,44.7 53.85,45.15 DA12.2 55.55,45.15 55.9,44.8 55.9,43.9 56.1,43.7 57.8,43.7 58.1,44 58.1,44.8 58.45,45.15 DA13.2 59.75,45.15 60.2,44.7 60.2,43.7 61.1,42.8 61.8,42.8 62.6,42 62.6,40.9 62.85,40.65 DB14.2 | DD13.2 58.25,31.65 | 58.25,31.65 58.1,31.5 58.1,30.6 57.1,29.6 56.8,29.6 56.1,28.9 56.1,20 | 56.1,20 55.7,19.6 55.7,18.6 55.25,18.15 DG12.2 53.95,18.15 53.6,17.8 53.6,15.2 53.6,14.9 | DG13.2 58.35,18.15 58.1,18.4 58.1,19.4 57.5,20 56.1,20 | DC14.2 62.65,36.15 62.4,35.9 62.4,35 61.5,34.1 59,34.1 58.25,33.35 58.25,31.65 | DG14.2 64.45,18.15 64.8,17.8 64.8,16.5 65.15,16.15 | DA16.2 73.35,45.15 73.7,45.5 73.7,47 73.8,47.1 v74,47.1 | v85.1,43.3 85.1,44.8 85.45,45.15 DA19.2 | DA18.2 80.85,45.15 80.6,45.4 v80.6,46 | DA17.2 76.45,45.15 76.1,45.5 v76.1,46.5 | v84.1,36.9 83.4,36.9 82.65,36.15 DC18.2 80.85,36.15 80.6,35.9 80.6,35.1 79.9,34.4 79,34.4 78.4,35 78.4,35.6 77.85,36.15 DC17.2 76.45,36.15 76.1,35.8 76.1,35.1 75.6,34.6 74.3,34.6 73.7,35.2 73.7,35.7 73.25,36.15 DC16.2 71.75,36.15 71.6,36 71.6,34.9 71,34.3 69.8,34.3 69.4,34.7 69.4,38.6 69.8,39 | 84.55,18.15 DG18.2 | DF19.2 85.15,22.65 85.1,22.7 | DE19.2 85.15,27.15 85.1,27.2 | DD19.2 85.15,31.65 85.1,31.7 | DG17.2 77.95,18.15 78.3,18.5 78.3,19.4 79,20.1 | 79,20.1 85.1,20.1 | DG16.2 73.35,18.15 73.8,18.6 73.8,19.8 74.4,20.4 78.7,20.4 79,20.1 | DB16.2 71.75,40.65 71.5,40.4 71.5,39.3 71.2,39 69.8,39 | 69.8,39 69.3,39.5 69.3,42.1 v70,42.8 | 41.5,13.5 QG.3 | 4.2,20.3 4.3,20.4 v6,20.4 8.4,20.4
  Top 0.254: 13.1,21.2 v12.3,21.2 | 29.1,21.3 v30,21.3 | 37.5,24.4 36.9,24.4 v36.8,24.5
  Top 0.406: DG11.2 49.2,18.15 49.1,18.05 49.1,15.9 48.5,15.3 v45.2,15.3 | 49,18.3 49,22.4 49.25,22.65 | v84.1,36.9 85.1,35.9 85.1,31.7 85.1,27.2 85.1,22.7 85.1,20.1 85.1,18.7 84.55,18.15 84.55,16.25 80.5,12.2 70.3,12.2 68.6,13.9 68.6,15.1 67.4,16.3 65.3,16.3 65.15,16.15 63.9,14.9 53.6,14.9 | 41.5,13.5 v42.8,13.5 43.5,13.5 v44.3,12.7 | 53.6,15.2 v50.7,15.2
  Top 0.508: 41.2,20.6 42.3,19.5 42.3,14.3 QG.3
  Route15 0.254: v12.3,21.2 12.3,20.4 | v30,21.3 30,20.4 | v36.8,24.5 36.8,22.2
  Route15 0.508: v6,20.4 12.3,20.4 30,20.4 32,20.4 33.8,22.2 36.8,22.2 40.1,22.2 41.2,21.1 v41.2,20.63
  Bottom 0.254: v48.5,35.6 49.2,36.3 49.2,40.5 v49.1,40.6 49.1,41.5 50.8,43.2 v51.5,43.2 | 76.1,47.1 v74,47.1 74,46.8 v70,42.8 | 76.1,47.1 80.1,47.1 | 80.1,47.1 82.97,47.1 83.26,46.81 84.39,46.81 85.1,46.1 v85.1,43.3 85.1,36.9 v84.1,36.9 | v80.6,46 80.1,46.5 80.1,47.1 | v76.1,46.5 76.1,47.1
  Bottom 0.406: v45.2,15.3 43.4,13.5 v42.8,13.5 | v50.7,15.2 47.1,15.2 44.6,12.7 v44.3,12.7
GND  (via drill 0.3, 0.3 pad 0.45, 0.3 pad 0.5)
  Top 0.2: U1.9 56.5,11.3 v56.6,11.4
  Top 0.254: R110.1 55.9,13.15 v55.9,12.3
  Top 0.305: v56.6,11.4 57.25,12.05 C6.2 57.05,12.3 v55.9,12.3 | U1.3 U1.11
  Top 0.406: v13.6,6.4 12.45,6.4 C5.2
  Top 0.508: J1.B1_A12 v74.2,8.5 v74.2,9.3 74.2,9.4 | J1.A1_B12 67.8,7.2 v66.9,8.1
  Top 0.61: Q4.2 v34.6,3.1 | Q5.2 v38.7,3.1 | Q6.2 v42.9,3.1 | Q3.2 40.05,9.05 v39.4,8.4 | Q2.2 35.8,9.1 v35.4,8.7 | Q1.2 31.65,8.7 v31.2,8.7 | v42.6,12.3 42.6,11.45 QG.2 v43.5,11.2 | QB.2 48.65,10.05 v48.7,10 | v38.1,13.5 37.95,13.35 QR.2 37.95,11.75 v38.4,11.3 | IC1.1 5.93,13.73 v6.3,14.1 6.4,14.2 C3.2
  Top 1.016: v60.5,11 C7.2 60.55,9.9 v62.1,9.9
  Bottom 0.406: C4.2 13.85,6.15 v13.6,6.4 | C1.2 29.85,13.25 v30.2,12.9 | IC2.8 29.64,4.05 v29.9,3.8
  other vias: 56,9 57,9 58,9 51.8,11.8 53.9,11.8 52.9,11.1 51.1,5.9
  pour Route2: -1,56 90.2,56 90.2,-0.7 -1,-0.7
  pour Top (no thermals): 55.8,9.2 51.3,9.2 51.3,12.2 54.2,12.2 54.2,11.1 55.5,9.8 55.8,9.8
  pour Bottom: -0.3,55.3 89.8,55.3 89.8,-0.9 -0.3,-0.9
  pour Top (rank 6): -1,-1 -1,16 90,16 90,-1
L1
  pour Top (rank 2, no thermals): 57.4,7.8 57.4,3.1 58.8,3.1 58.8,6 57.6,7.2 57.6,7.8
L2
  pour Top (rank 2, no thermals): 56.4,7.8 56.4,7 55.2,5.8 55.2,3.2 56.6,3.2 56.6,7.8
N$1  (via drill 0.3 pad 0.45)
  Top 0.203: DA2.4 DA2.5 DA2.6 v7.5,43.4
  Bottom 0.203: v7.5,43.4 R1.1
N$2
  Top 0.203: R2.1 DA3.4 DA3.5 DA3.6
N$3
  Top 0.203: DA4.6 DA4.5 DA4.4 R3.1
N$4
  Top 0.203: R4.1 DA5.4 DA5.5 DA5.6
N$5
  Top 0.203: DA6.6 DA6.5 DA6.4 R5.1
N$6
  Top 0.203: R6.1 DA7.4 DA7.5 DA7.6
N$7
  Top 0.203: R7.1 DA8.4 DA8.5 DA8.6
N$8
  Top 0.203: DA9.6 DA9.5 DA9.4 R8.1
N$9
  Top 0.203: R9.1 DA10.4 DA10.5 DA10.6
N$10
  Top 0.203: DA11.6 DA11.5 DA11.4 R10.1
N$11
  Top 0.203: R11.1 DA12.4 DA12.5 DA12.6
N$12
  Top 0.203: DA13.6 DA13.5 DA13.4 R12.1
N$13
  Top 0.203: DA14.6 DA14.5 DA14.4 R13.1
N$14
  Top 0.203: DA15.6 DA15.5 DA15.4 R14.1
N$15
  Top 0.203: DA16.6 DA16.5 DA16.4 R15.1
N$16
  Top 0.203: R16.1 DA17.4 DA17.5 DA17.6
N$17
  Top 0.203: DA18.6 DA18.5 DA18.4 79.3,46.2 79.3,46.7 78.7,47.3 78.2,47.3 78,47.5 R17.1
N$18
  Top 0.203: R18.1 80,47.35 80.6,46.75 82.05,46.75 82.8,46 DA19.4 DA19.5 DA19.6
N$19
  Top 0.203: R19.1 3.2,41.7 DB1.4 DB1.5 DB1.6
N$20
  Top 0.203: DB2.6 DB2.5 DB2.4 7.5,42.2 6.9,42.8 6,42.8 5.5,43.3 R20.1
N$21  (via drill 0.3 pad 0.45)
  Top 0.203: v16.5,39 DB4.6 DB4.5 DB4.4
  Bottom 0.203: R21.1 v16.5,39
N$22  (via drill 0.3 pad 0.45)
  Top 0.203: v25.5,39 DB6.6 DB6.5 DB6.4
  Bottom 0.203: v25.5,39 R22.1
N$23  (via drill 0.3 pad 0.45)
  Top 0.203: v34.5,38.8 DB8.6 DB8.5 DB8.4
  Bottom 0.203: R23.1 v34.5,38.8
N$24  (via drill 0.3 pad 0.45)
  Top 0.203: v39,38.9 DB9.6 DB9.5 DB9.4
  Bottom 0.203: v39,38.9 R24.1
N$25
  Top 0.203: 47.98,39.82 46.73,39.65 R25.1 | 47.95,39.85 47.98,39.82 | 47.98,39.82 DB11.6
  Top 0.254: DB11.4 DB11.5 48,39.9 47.95,39.85
N$26
  Top 0.203: R26.1 49.85,37.7 50.85,38.7 52.1,38.7 52.5,39.1 DB12.6 DB12.5 DB12.4
N$27  (via drill 0.3)
  Top 0.2: R27.1 v59.3,47.6 | v60,41.5 61.4,41.5 61.5,41.4
  Top 0.203: DB14.6 DB14.5 61.5,41.4 DB14.4
  Top 0.254: 61.45,39.75 DB14.6
  Route15 0.2: v59.3,47.6 59.3,42.2 v60,41.5
N$28  (via drill 0.3)
  Top 0.2: DB15.6 66,39 v65.8,38.8 | v63.2,47.8 63.2,48.55 R28.1
  Top 0.203: DB15.6 DB15.5 DB15.4
  Route15 0.2: v65.8,38.8 65.8,40.9 62.9,43.8 62.9,47.3 63.2,47.6 v63.2,47.8
N$29
  Top 0.2: R29.1 74.15,42.3 73,42.3
  Top 0.203: 73,42.3 70.7,42.3 70.5,42.1 DB16.4 DB16.5 DB16.6
N$30  (via drill 0.3 pad 0.45)
  Top 0.203: v7.5,34.4 DC2.6 DC2.5 DC2.4
  Bottom 0.203: R30.1 v7.5,34.4
N$31  (via drill 0.3 pad 0.45)
  Top 0.203: DC4.4 DC4.5 DC4.6 v16.5,34.4
  Bottom 0.203: R31.1 v16.5,34.4
N$32  (via drill 0.3 pad 0.45)
  Top 0.203: v25.5,34.4 DC6.6 DC6.5 DC6.4
  Bottom 0.203: R32.1 v25.5,34.4
N$33  (via drill 0.3 pad 0.45)
  Top 0.203: v34.5,34.3 DC8.6 DC8.5 DC8.4
  Bottom 0.203: R33.1 v34.5,34.3
N$34  (via drill 0.3 pad 0.45)
  Top 0.203: v39,34.5 DC9.6 DC9.5 DC9.4
  Bottom 0.203: v39,34.5 R34.1
N$35  (via drill 0.3)
  Top 0.2: DC12.4 v51.3,37 | v47.7,27.9 46.55,27.9 R35.1
  Top 0.305: DC12.6 DC12.5 DC12.4
  Route15 0.2: v51.3,37 52.3,36 52.3,31.2 48.6,27.5 48.1,27.5 v47.7,27.9
N$36
  Top 0.203: R36.1 61.25,35.05 DC14.6 DC14.5 DC14.4
N$37
  Top 0.203: R37.1 57,37.15 57.85,38 65.5,38 66,37.5 DC15.4 DC15.5 DC15.6
N$38  (via drill 0.3)
  Top 0.2: R38.1 71.8,48.15 v71.8,47.9 | v70.5,38 DC16.4
  Top 0.203: DC16.4 DC16.5 DC16.6
  Route15 0.2: v71.8,47.9 71.4,47.5 71.4,38.9 v70.5,38
N$39
  Top 0.203: DC17.4 75.1,37
  Top 0.254: 75,36.9 75.1,37 | DC17.6 DC17.5 | 75,37.7 75.5,38.2 79.2,38.2 80.55,39.55 R39.1
  Top 0.305: DC17.5 75,36.9 | DC17.4 75,37.7
N$40
  Top 0.203: DC18.4 DC18.5 DC18.6
  Top 0.254: DC18.4 79.5,37.4 80,37.9 82.6,37.9 83.4,38.7 R40.1
N$41  (via drill 0.3 pad 0.45)
  Top 0.203: v7.5,30 DD2.6 DD2.5 DD2.4
  Bottom 0.203: v7.5,30 R41.1
N$42  (via drill 0.3 pad 0.45)
  Top 0.203: DD3.4 DD3.5 DD3.6 v12,30
  Bottom 0.203: v12,30 R42.1
N$43  (via drill 0.3 pad 0.45)
  Top 0.203: v16.5,29.9 DD4.6 DD4.5 DD4.4
  Bottom 0.203: R43.1 v16.5,29.9
N$44  (via drill 0.3 pad 0.45)
  Top 0.203: v21,29.9 DD5.6 DD5.5 DD5.4
  Bottom 0.203: v21,29.9 R44.1
N$45  (via drill 0.3 pad 0.45)
  Top 0.203: v25.5,29.9 DD6.6 DD6.5 DD6.4
  Bottom 0.203: v25.5,29.9 R45.1
N$46  (via drill 0.3 pad 0.45)
  Top 0.203: DD8.4 DD8.5 DD8.6 v34.5,29.9
  Bottom 0.203: R46.1 v34.5,29.9
N$47  (via drill 0.3 pad 0.45)
  Top 0.203: v39,29.8 DD9.6 DD9.5 DD9.4
  Bottom 0.203: R47.1 v39,29.8
N$48
  Top 0.203: R48.1 43.5,34.05 DD10.4 DD10.5 DD10.6
N$49  (via drill 0.3)
  Top 0.152: DD11.6 DD11.5 DD11.4
  Top 0.2: DD11.6 48.1,30.8 v49,29.9 | v46,29.4 44.6,29.4 44.1,28.9 R49.1
  Route15 0.2: v49,29.9 46.5,29.9 v46,29.4
N$50
  Top 0.203: DD13.6 DD13.5 DD13.4
  Top 0.254: R50.1 55.25,30.8 DD13.6
N$51
  Top 0.203: R51.1 60,28.5 61.5,30 DD14.6 DD14.5 DD14.4
N$52
  Top 0.203: 68.7,29.2 67.1,29.2 66,30.3 DD15.6 DD15.5 DD15.4
  Top 0.254: 68.7,29.2 69.5,28.4 69.5,26.7 69.8,26.4 R52.1
N$53
  Top 0.203: DD16.4 DD16.5 DD16.6
  Top 0.254: R53.1 70.5,28.45 DD16.6
N$54
  Top 0.203: 75.3,29.9 75,30.2 DD17.6 DD17.5 DD17.4
  Top 0.254: R54.1 77.05,29.45 76.8,29.7 75.5,29.7 75.3,29.9
N$55
  Top 0.203: R55.1 81.8,31.65 DD19.5 | DD19.5 DD19.4 | DD19.6 DD19.5
N$56  (via drill 0.3 pad 0.45)
  Top 0.203: DE2.4 DE2.5 DE2.6 v7.5,25.5
  Bottom 0.203: R56.1 v7.5,25.5
N$57  (via drill 0.3 pad 0.45)
  Top 0.203: DE4.4 DE4.5 DE4.6 v15.5,26.3
  Bottom 0.203: R57.1 15.55,26.35 v15.5,26.3
N$58  (via drill 0.3 pad 0.45)
  Top 0.203: DE6.4 DE6.5 DE6.6 v24.5,26.3
  Bottom 0.203: R58.1 25.45,26.3 v24.5,26.3
N$59  (via drill 0.3 pad 0.45)
  Top 0.203: v30,25.4 DE7.6 DE7.5 DE7.4
  Bottom 0.203: R59.1 v30,25.4
N$60  (via drill 0.3 pad 0.45)
  Top 0.203: DE8.4 DE8.5 DE8.6 v34.5,25.2
  Bottom 0.203: R60.1 v34.5,25.2
N$61  (via drill 0.3 pad 0.45)
  Top 0.203: v39,25.3 DE9.6 DE9.5 DE9.4
  Bottom 0.203: v39,25.3 R61.1
N$62  (via drill 0.3 pad 0.45)
  Top 0.203: v51.5,25.7 51.9,25.7 DE12.6 DE12.5 DE12.4
  Bottom 0.203: R62.1 52.35,25.7 v51.5,25.7
N$63  (via drill 0.3 pad 0.45)
  Top 0.203: DE14.4 DE14.5 DE14.6 v61.5,24.9
  Bottom 0.254: R63.1 59.45,24.45 59.9,24.9 v61.5,24.9
N$64  (via drill 0.3 pad 0.45)
  Top 0.203: DE15.4 DE15.5 DE15.6 v66,25
  Bottom 0.254: v66,25 66.15,24.85 R64.1
N$65  (via drill 0.3 pad 0.45)
  Top 0.203: v84,25.3 DE19.6 DE19.5 DE19.4
  Bottom 0.203: v84,25.3 R65.1
N$66  (via drill 0.3 pad 0.45)
  Top 0.203: v3,21 DF1.6 DF1.5 DF1.4
  Bottom 0.203: v3,21 R66.1
N$67  (via drill 0.3 pad 0.45)
  Top 0.203: v6.6,21.8 DF2.6 DF2.5 DF2.4
  Bottom 0.203: R67.1 7.45,21.8 v6.6,21.8
N$68  (via drill 0.3 pad 0.45)
  Top 0.203: v15.5,21.7 16.4,21.7 DF4.6 DF4.5 DF4.4
  Bottom 0.203: v15.5,21.7 16.35,21.7 R68.1
N$69  (via drill 0.3 pad 0.45)
  Top 0.203: v24.4,21.7 25.4,21.7 DF6.6 DF6.5 DF6.4
  Bottom 0.203: R69.1 25.35,21.7 v24.4,21.7
N$70  (via drill 0.3 pad 0.45)
  Top 0.203: v34.5,20.9 DF8.6 DF8.5 DF8.4
  Bottom 0.203: v34.5,20.9 33.95,21.45 R70.1
N$71  (via drill 0.3 pad 0.45)
  Top 0.203: v39,20.9 DF9.6 DF9.5 DF9.4
  Bottom 0.203: v39,20.9 R71.1
N$72  (via drill 0.3 pad 0.45)
  Top 0.203: v46.9,21.6 47.8,21.6 DF11.6 DF11.5 DF11.4
  Bottom 0.203: R72.1 47.75,21.6 v46.9,21.6
N$73  (via drill 0.3 pad 0.45)
  Top 0.203: v51.5,21.6 52.3,21.6 DF12.6 DF12.5 DF12.4
  Bottom 0.203: v51.5,21.6 52.25,21.6 R73.1
N$74  (via drill 0.3 pad 0.45)
  Top 0.203: v60.4,21.7 61.4,21.7 DF14.6 DF14.5 DF14.4
  Bottom 0.203: R74.1 61.35,21.7 v60.4,21.7
N$75  (via drill 0.3 pad 0.45)
  Top 0.203: v65,21.6 65.8,21.6 DF15.6 DF15.5 DF15.4
  Bottom 0.203: R75.1 65.75,21.6 v65,21.6
N$76
  Top 0.2: R76.1 R110.2 54.9,12.45 54.9,11 55.5,10.4 U1.10
N$77  (via drill 0.3 pad 0.45)
  Top 0.203: v84,20.9 DF19.6 DF19.5 DF19.4
  Bottom 0.203: v84,20.9 R77.1
N$78  (via drill 0.3 pad 0.45)
  Top 0.203: v3.1,16.2 3.1,17.2 DG1.6 DG1.5 DG1.4
  Bottom 0.203: v3.1,16.2 3,16.3 R78.1
N$79  (via drill 0.3 pad 0.45)
  Top 0.203: v7.5,16.4 DG2.6 DG2.5 DG2.4
  Bottom 0.203: v7.5,16.4 R79.1
N$80  (via drill 0.3 pad 0.45)
  Top 0.203: v12.1,16.6 12.1,17.2 DG3.6 DG3.5 DG3.4
  Bottom 0.203: R80.1 12.1,17.25 v12.1,16.6
N$81  (via drill 0.3 pad 0.45)
  Top 0.203: v16.5,16.6 DG4.6 DG4.5 DG4.4
  Bottom 0.203: v16.5,16.6 17.05,17.15 R81.1
N$82  (via drill 0.3 pad 0.45)
  Top 0.203: v21,16.5 DG5.6 DG5.5 DG5.4
  Bottom 0.203: v21,16.5 R82.1
N$83  (via drill 0.3 pad 0.45)
  Top 0.203: v24.6,17.2 25.4,17.2 DG6.6 DG6.5 DG6.4
  Bottom 0.203: R83.1 25.35,17.2 v24.6,17.2
N$84  (via drill 0.3 pad 0.45)
  Top 0.203: v30,16.5 DG7.6 DG7.5 DG7.4
  Bottom 0.203: v30,16.5 R84.1
N$85  (via drill 0.3 pad 0.45)
  Top 0.203: v34.5,16.4 DG8.6 DG8.5 DG8.4
  Bottom 0.203: v34.5,16.4 34.35,16.55 R85.1
N$86  (via drill 0.3 pad 0.45)
  Top 0.203: v39,16.5 DG9.6 DG9.5 DG9.4
  Bottom 0.203: v39,16.5 38.75,16.75 R86.1
N$87  (via drill 0.3 pad 0.45)
  Top 0.203: v43.5,16.6 DG10.6 DG10.5 DG10.4
  Bottom 0.203: R87.1 43.85,16.95 v43.5,16.6
N$88  (via drill 0.3 pad 0.45)
  Top 0.203: v48,16.4 DG11.6 DG11.5 DG11.4
  Bottom 0.203: v48,16.4 R88.1
N$89  (via drill 0.3 pad 0.45)
  Top 0.203: v52.5,16.1 DG12.6 DG12.5 DG12.4
  Bottom 0.203: v52.5,16.1 R89.1
N$90  (via drill 0.3 pad 0.45)
  Top 0.203: v56.1,17.2 56.9,17.2 DG13.6 DG13.5 DG13.4
  Bottom 0.203: R90.1 56.85,17.2 v56.1,17.2
N$91  (via drill 0.3 pad 0.45)
  Top 0.203: v60.6,17.2 61.4,17.2 DG14.6 DG14.5 DG14.4
  Bottom 0.203: v60.6,17.2 61.35,17.2 R91.1
N$92  (via drill 0.3 pad 0.45)
  Top 0.203: v66.9,17.2 66.1,17.2 DG15.6 DG15.5 DG15.4
  Bottom 0.203: R92.1 66.15,17.2 v66.9,17.2
N$93  (via drill 0.3 pad 0.45)
  Top 0.203: v69.7,17.2 70.5,17.2 DG16.6 DG16.5 DG16.4
  Bottom 0.203: v69.7,17.2 70.35,17.2 R93.1
N$94  (via drill 0.3 pad 0.45)
  Top 0.203: v74,17 74.3,17.3 DG17.6 DG17.5 DG17.4
  Bottom 0.203: v74,17 74.65,17 R94.1
N$95  (via drill 0.3 pad 0.45)
  Top 0.203: v79.5,16.5 DG18.6 DG18.5 DG18.4
  Bottom 0.203: v79.5,16.5 R95.1
N$103
  Top 0.508: J1.A4_B9 68.6,8.3 73.3,8.3 73.4,8.2 J1.B4_A9
  Top 1.016: PWR.L 66.2,10.7 68.6,8.3
N$104
  Bottom 1.016: PWR.R 77.2,15.9 77.2,21.9 76.24,22.86 76.24,35.54 78.1,37.4 BAT1.POS
Q1B
  Top 0.2: R101.1 31.8,11.5 33.95,9.35 Q1.1
Q2B
  Top 0.2: R102.1 37.7,8 37.95,8.25 Q2.1
Q3B  (via drill 0.3 pad 0.5)
  Top 0.2: R103.1 30.8,5.6 v31.2,6 | v43.4,9.1 Q3.1
  Bottom 0.2: v31.2,6 41.6,6 43.4,7.8 v43.4,9.1
Q4B
  Top 0.2: R104.1 28.62,3.1 Q4.1
Q5B
  Top 0.2: R105.1 23.6,8 24.7,6.9 24.7,5.3 25.4,4.6 31.7,4.6 32.1,4.2 35.1,4.2 36.05,3.25 Q5.1
Q6B  (via drill 0.3 pad 0.5)
  Top 0.2: R106.1 23.7,12 24.2,11.5 v24.2,9.3 | v39.6,4.3 40.05,3.85 Q6.1
  Route15 0.2: v24.2,9.3 24.2,6 25.6,4.6 29,4.6 29.3,4.9 38.8,4.9 39.4,4.3 v39.6,4.3
QBB  (via drill 0.3 pad 0.5)
  Top 0.2: v46.6,10.1 46.6,11.05 QB.1
  Bottom 0.2: R100.1 46.55,10.05 v46.6,10.1
QGB  (via drill 0.3 pad 0.5)
  Top 0.406: QG.1 39.9,11.2 v39.5,10.8
  Bottom 0.406: v39.5,10.8 39.5,11.25 R99.1
QRB  (via drill 0.3 pad 0.5)
  Top 0.406: v35.1,12.3 35.95,12.3 QR.1
  Bottom 0.406: R98.1 35,12.2 v35.1,12.3
R-  (via drill 0.3, 0.3 pad 0.45, 0.3 pad 0.5, 0.35)
  Top 0.254: 38.1,42.8 38.1,45.5 37.6,46 DA8.3 35.9,46 35.7,45.8 35.7,43.3 36.6,42.4 DB8.3 | DA2.3 v10.6,46 | v9.4,42.4 9.6,42.2 DB2.3 | v12.8,42.1 11.2,40.5 11.2,37.9 | 11.2,37.9 v11.9,37.9 | v9.5,38.1 9.6,38 DC2.3 | 11.2,37.9 11.2,33.8 | 11.2,33.8 11.2,32.9 11.1,32.8 11.1,28.8 | 11.1,28.8 11.1,24.7 v12.3,24.7 | DD2.3 v9.6,33.6 | v11.9,33.9 11.8,33.8 11.2,33.8 | DE2.3 9.6,28.8 v9.5,28.9 | v12,28.8 11.1,28.8 | DF2.3 9.5,23.6 v9.5,24.7 | DD4.3 18,32.5 17.6,32.1 17.6,28 | 17.6,28 17.6,23.5 DF4.3 | DE4.3 17.6,28 | DA6.3 28.4,46 28.6,45.8 28.6,42.3 27.8,41.5 DB6.3 26.6,41.5 26.3,41.2 26.3,37 | DG5.3 23.1,19.7 23.4,20 25.9,20 26.3,20.4 26.3,23.5 | 26.3,37 26.3,32.5 | 26.3,32.5 26.3,28 | 26.3,28 26.3,24.8 26.3,23.5 | DF6.3 26.3,23.5 | DE6.3 26.3,28 | DD6.3 26.3,32.5 | DC6.3 26.3,37 | DC8.3 35.8,37 35.5,36.7 35.5,32.5 | 35.8,23.5 35.3,24 35.3,28 35.5,28 | 35.8,23.5 DF8.3 | 35.5,32.5 35.5,28 | 35.6,14.7 35.7,14.6 | DE8.3 35.5,28 | DD8.3 35.5,32.5 | 38.1,42.8 39.1,42.8 40.1,43.8 40.1,45.8 40.3,46 DA9.3 41.8,46 42.3,45.5 42.3,43.6 42.9,43 43.9,43 44.6,43.7 44.6,45.7 44.9,46 DA10.3 46.4,46 46.7,45.7 46.7,44 47.2,43.5 48.6,43.5 49,43.9 49,45.7 49.3,46 DA11.3 | 35.8,23.5 35.6,23.3 v35.6,21.2 | 36.7,19.1 DG8.3 | v41.3,33.2 41.3,32.7 DD9.3 41.9,32.5 42.1,32.3 42.1,21.3 v42.7,20.7 | v44.7,32.5 DD10.3 | v49.1,32.5 DD11.3 51.1,32.5 53.4,34.8 53.4,36.6 53.6,36.8 | DC12.3 53.8,37 53.6,36.8 | DB12.3 53.7,41.5 53.3,41.1 53.3,37.1 53.6,36.8 | v67.5,29.9 67.4,29.9 66.9,30.4 66.9,32.5 | v65.6,29.3 66.2,28.7 66.6,28.7 67.3,28 | DE15.3 67.3,28 | 67.2,41.5 67.2,45.9 67.3,46 DA15.3 68.1,47.1 v68,47.2 | 66.9,37 66.9,41.5 67.2,41.5 | 66.9,37 66.9,32.5 | DD15.3 66.9,32.5
  Top 0.254: DC15.3 66.9,37 | DB15.3 67.2,41.5 | 67.3,28 67,27.7 67,23.5 | 67,23.5 67,20.1 | 67,20.1 67,19.2 67.2,19 DG15.3 68.8,19 69.5,19.7 71.8,19.7 72.5,19 DG16.3 | DG14.3 63.6,19.5 63.95,19.85 64.2,20.1 67,20.1 | DF15.3 67,23.5 | DA14.3 63.6,46.6 v64.2,47.2 | DA16.3 v72.6,46.8 | QR.3 37.7,14.6 38.1,15 38.1,42.8 | DG3.3 14.8,19 v15.1,19.3
  Top 0.305: 63.95,19.85 63.95,20.15 v63.5,20.6 | DF4.3 19.9,24.8 26.3,24.8
  Top 0.406: DG8.3 35.8,19 35.6,18.8 35.6,14.7 | v36.7,19.9 36.7,19.1 | 26.3,24.8 28,24.8 v28.2,24.6
  Top 0.508: QR.3 35.7,14.6
  Route15 0.406: v28.2,24.6 31.3,21.5 v31.5,21.5
  Bottom 0.254: v10.6,46 12,44.6 12,42.2 | 12,42.2 11.6,41.8 10,41.8 v9.4,42.4 | 12,42.2 12.2,42 12.7,42 v12.8,42.1 | v11.9,37.9 9.7,37.9 v9.5,38.1 | v9.6,33.6 11.6,33.6 v11.9,33.9 | v9.5,28.9 11.9,28.9 v12,28.8 | v9.5,24.7 v12.3,24.7 | 36.7,20.1 v36.7,19.9 | v41.3,33.2 44,33.2 v44.7,32.5 v49.1,32.5 | v67.5,29.9 66.9,29.3 v65.6,29.3 | v64.2,47.2 v68,47.2 71,47.2 71.4,46.8 v72.6,46.8 | v15.1,19.3 16.1,20.3 31.4,20.3 32.05,20.95
  Bottom 0.305: v63.5,20.6 63,20.1 43.3,20.1 v42.7,20.7
  Bottom 0.406: v35.6,21.2 36.7,20.1 | v42.7,20.7 41.9,19.9 v36.7,19.9 33.1,19.9 32.05,20.95 v31.5,21.5 | v12.3,24.7 28.1,24.7 v28.2,24.6
TR  (via drill 0.3)
  Top 0.2: IC1.2 8.27,11.13 9.54,9.87 IC1.6 12.11,9.9 v13.6,9.9
  Bottom 0.2: R109.1 R97.1 | C4.1 14.5,8.35 R97.1 | R97.1 13.65,9.85 v13.6,9.9
VINA
  Top 0.305: R108.1 C6.1 58.95,11.35 U1.6 U1.7 U1.8

## Text on the board
bPlace: Congrats Grad! | JLCJLCJLCJLC | Designed by Will Buchta / 4/2025